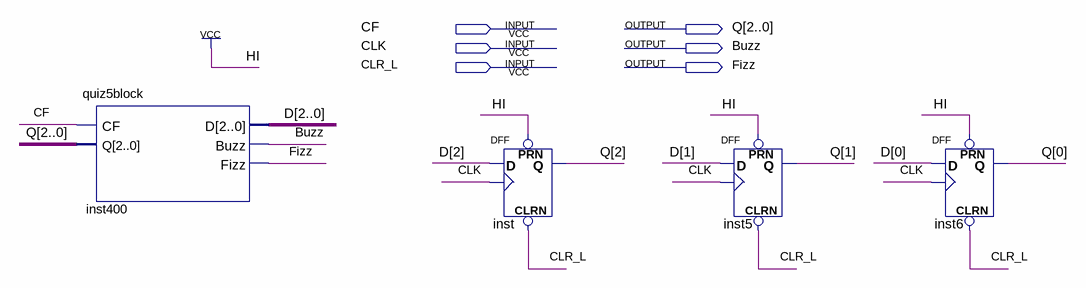
[diagram p0: schematic sheet]
// Quartus schematic Quiz5.bdf as structural Verilog: 4 symbols, 6 pins
module Quiz5 (
  input  CF,
  input  CLK,
  input  CLR_L,
  output [2:0] Q,
  output Buzz,
  output Fizz
);

  wire [2:0] D;

  quiz5block inst400 (.CF(CF), .Q(Q), .D(D), .Buzz(Buzz), .Fizz(Fizz));
  DFF inst (.CLRN(CLR_L), .CLK(CLK), .D(D[2]), .PRN(1'b1), .Q(Q[2]));
  DFF inst5 (.CLRN(CLR_L), .CLK(CLK), .D(D[1]), .PRN(1'b1), .Q(Q[1]));
  DFF inst6 (.CLRN(CLR_L), .CLK(CLK), .D(D[0]), .PRN(1'b1), .Q(Q[0]));
endmodule
